# Altium schematic sheet Logic_buffer.SchDoc: Bernardo
size A3; Date: 14/11/2018; DrawnBy: Wim Van Gool; Revision: 01; SheetNumber: 3; SheetTotal: 7
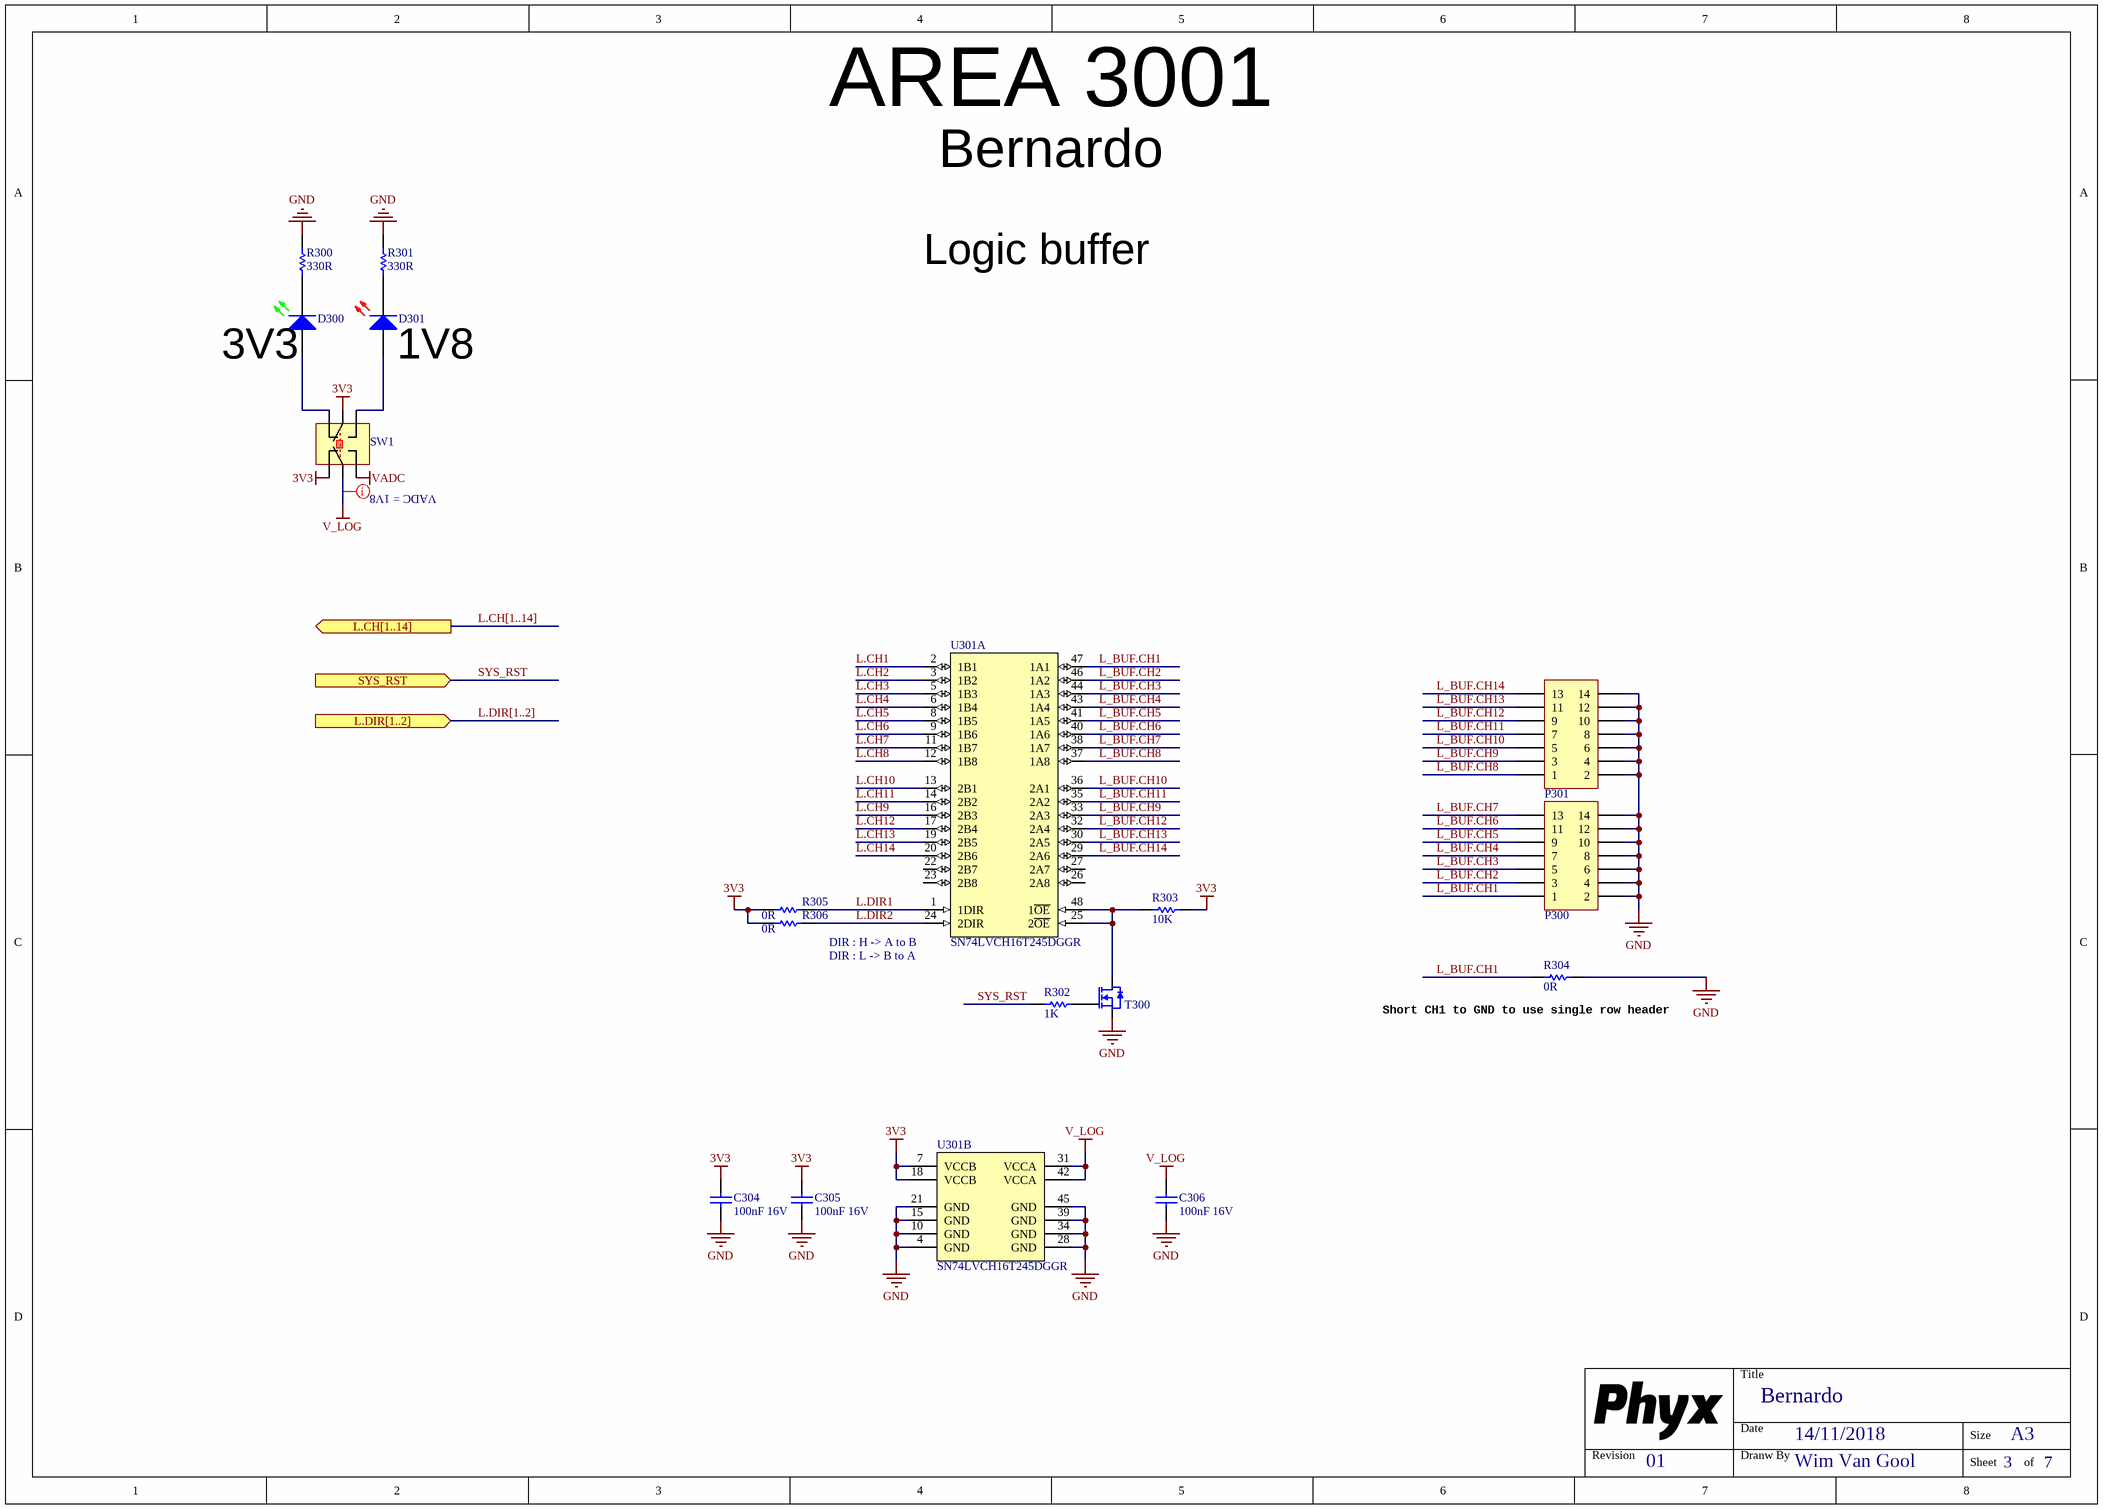
[diagram p0: Logic_buffer.SchDoc]

## Parts
C304  value 100nF 16V  [C0603_N]  (hidden comment: CAP_CERAMIC)
C305  value 100nF 16V  [C0603_N]  (hidden comment: CAP_CERAMIC)
C306  value 100nF 16V  [C0603_N]  (hidden comment: CAP_CERAMIC)
D300  Default 0805 Green LED  [LED_0805_GR]  (value not drawn)
D301  Default 0805 Red LED  [LED_0805_RD]  (value not drawn)
P300  Header 7X2  [HDR2X7]  (value not drawn)
P301  Header 7X2  [HDR2X7]  (value not drawn)
R300  value 330R  [R0603_N]  (hidden comment: RESISTOR)
R301  value 330R  [R0603_N]  (hidden comment: RESISTOR)
R302  value 1K  [R0603_N]  (hidden comment: RESISTOR)
R303  value 10K  [R0603_N]  (hidden comment: RESISTOR)
R304  value 0R  [R0603_N]  (hidden comment: RESISTOR)
R305  value 0R  [R0603_N]  (hidden comment: RESISTOR)
R306  value 0R  [R0603_N]  (hidden comment: RESISTOR)
SW1  mini Switch 2 pole double throw straight 50V 0.3A  [SS22D07]  (value not drawn)
T300  0.2A N-Ch MOSFET Vgs 3.2  [SOT23-3]  (value not drawn)
U301  value SN74LVCH16T245DGGR  [TI_DGG_R-PDSO-G48]  (hidden comment: SN74LVCH16T245DGGR  Bus Transceiver LVC 16Ch 32 mA 6 ns 1V65 to 5V5 TSSOP48)  (parts A,B of 2)

## Ports
L.CH[1..14] (out), L.DIR[1..2] (in), SYS_RST (in)

## Nets
3V3: C304.1 C305.1 R303.1 R305.2 R306.2 SW1.2 SW1.3 U301.7(VCCB) U301.18(VCCB)
GND: C304.2 C305.2 C306.2 P300.2 P300.4 P300.6 P300.8 P300.10 P300.12 P300.14 P301.2 P301.4 P301.6 P301.8 P301.10 P301.12 P301.14 R300.1 R301.1 R304.1 T300.2(S) U301.4(GND) U301.10(GND) U301.15(GND) U301.21(GND) U301.28(GND) U301.34(GND) U301.39(GND) U301.45(GND)
V_LOG: C306.1 SW1.4 U301.31(VCCA) U301.42(VCCA)
VADC: SW1.6
L.CH1: U301.2(1B1)
L.CH2: U301.3(1B2)
L.CH3: U301.5(1B3)
L.CH4: U301.6(1B4)
L.CH5: U301.8(1B5)
L.CH6: U301.9(1B6)
L.CH7: U301.11(1B7)
L.CH8: U301.12(1B8)
L.CH9: U301.16(2B3)
L.CH10: U301.13(2B1)
L.CH11: U301.14(2B2)
L.CH12: U301.17(2B4)
L.CH13: U301.19(2B5)
L.CH14: U301.20(2B6)
L.DIR1: R305.1 U301.1(1DIR)
L.DIR2: R306.1 U301.24(2DIR)
L_BUF.CH1: P300.1 R304.2 U301.47(1A1)
L_BUF.CH2: P300.3 U301.46(1A2)
L_BUF.CH3: P300.5 U301.44(1A3)
L_BUF.CH4: P300.7 U301.43(1A4)
L_BUF.CH5: P300.9 U301.41(1A5)
L_BUF.CH6: P300.11 U301.40(1A6)
L_BUF.CH7: P300.13 U301.38(1A7)
L_BUF.CH8: P301.1 U301.37(1A8)
L_BUF.CH9: P301.3 U301.33(2A3)
L_BUF.CH10: P301.5 U301.36(2A1)
L_BUF.CH11: P301.7 U301.35(2A2)
L_BUF.CH12: P301.9 U301.32(2A4)
L_BUF.CH13: P301.11 U301.30(2A5)
L_BUF.CH14: P301.13 U301.29(2A6)
SYS_RST: R302.2 ; port SYS_RST
NetD300_1: D300.1(A) SW1.1
NetD300_2: D300.2(K) R300.2
NetD301_1: D301.1(A) SW1.5
NetD301_2: D301.2(K) R301.2
NetR302_1: R302.1 T300.1(G)
NetR303_2: R303.2 T300.3(D) U301.25(2~{OE}) U301.48(1~{OE})

Not connected (* = marked no-connect by the designer): U301 22(2B7) 23(2B8) 26(2A8) 27(2A7)

## Buses and harness runs
bus L.CH[1..14] = port L.CH[1..14]
bus L.DIR[1..2] = port L.DIR[1..2]

## Layout directives
net class POWER: V_LOG

## Notes on the sheet
- AREA 3001
- Bernardo
- Logic buffer
- (near D300) 3V3
- (near D301) 1V8
- (near SW1) VADC = 1V8
- DIR : H -> A to B
- DIR : L -> B to A
- (near R304) Short CH1 to GND to use single row header
- Title
- Revision
- Date
- Dranw By
- Size
- A3
- Sheet
- of

## Library data of the parts
C304-C306 = CAP # 100nF 16V 0603: Capacitor Ceramic
D300 = LED # Green 0805: =Description; Supplier 1: Farnell; Supplier Part Number 1: 2099239
D301 = LED # Red 0805: =Description; Supplier 1: Farnell; Supplier Part Number 1: 2099236
P300 P301 = Pin Header 2.54mm dual row 14way
R300 R301 = RES # 330R 0603: Supplier 1: Farnell; Supplier Part Number 1: 2446656
R302 = RES # 1K 0603
R303 = RES # 10K 0603: Supplier 1: Farnell; Supplier Part Number 1: 2502397
R304-R306 = RES # 0R 0603: Supplier 1: Farnell; Supplier Part Number 1: 2447743
SW1 = SW 2P2T micro straight SS22D07: Value: SS22D07; Supplier 1: AliExpress
T300 = BSS138 N-Ch MOSFET 0.2A 3.2Vgs 60Vds: Value: BSS138; Supplier 1: Farnell; Supplier Part Number 1: 2432717
U301 = LVL # 16Ch SN74LVCH16T245DGGR: =Description; Supplier 1: Farnell; Supplier Part Number 1: 2308692